# Altium schematic sheet TColour2to3.SchDoc: LiveDesign Evaluation - Countdown
size A4; Organization: Altium Limited; Address1: L3, 12a Rodborough Rd; Address2: Frenchs Forest; Address3: NSW; Address4: Australia 2086; DocumentNumber: 7; SheetNumber: 7; SheetTotal: 11
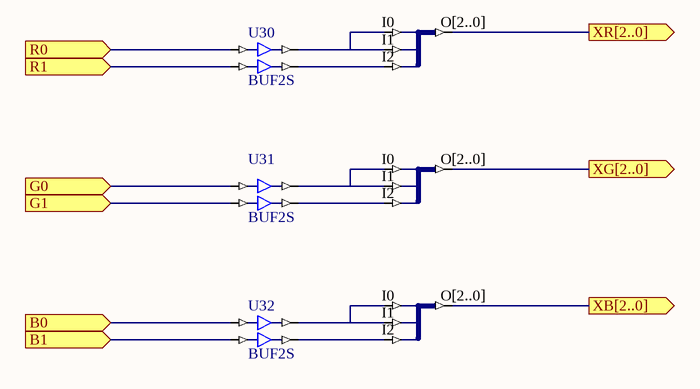
[diagram p0: TColour2to3.SchDoc]

## Parts
U27  J3S_3B  (value not drawn)
U28  J3S_3B  (value not drawn)
U29  J3S_3B  (value not drawn)
U30  BUF2S
U31  BUF2S
U32  BUF2S

## Ports
B0 (in), B1 (in), G0 (in), G1 (in), R0 (in), R1 (in), XB[2..0] (out), XG[2..0] (out), XR[2..0] (out)

## Nets
B0: U32.I0 ; port B0
B1: U32.I1 ; port B1
G0: U31.I0 ; port G0
G1: U31.I1 ; port G1
R0: U30.I0 ; port R0
R1: U30.I1 ; port R1
XB[2..0]: U29.O[2..0] ; port XB[2..0]
XG[2..0]: U28.O[2..0] ; port XG[2..0]
XR[2..0]: U27.O[2..0] ; port XR[2..0]
NetU27_I0: U27.I0 U27.I1 U30.O0
NetU27_I2: U27.I2 U30.O1
NetU28_I0: U28.I0 U28.I1 U31.O0
NetU28_I2: U28.I2 U31.O1
NetU29_I0: U29.I0 U29.I1 U32.O0
NetU29_I2: U29.I2 U32.O1

## Notes on the sheet
- Title
- Size:
- Date:
- A4
- Number:
- Time:
- Revision:
- Sheet
- of
- File:

## Library data of the parts
U27-U29 = J3S_3B: 3 Single pin inputs to single 3-Bit output bus; ArchiveName: GENERIC; VHDLIB_SIM: GENERIC_LIB; Published: 29-Jan-2004; Publisher: Altium Limited; Core Revision: 1.00.00
U30-U32 = BUF2S: 2-Bit General Purpose (Non-inverting) Buffer, Single Pin Version; ArchiveName: GENERIC; VHDLIB_SIM: GENERIC_LIB; Published: 29-Jan-2004; Publisher: Altium Limited; Core Revision: 1.00.00